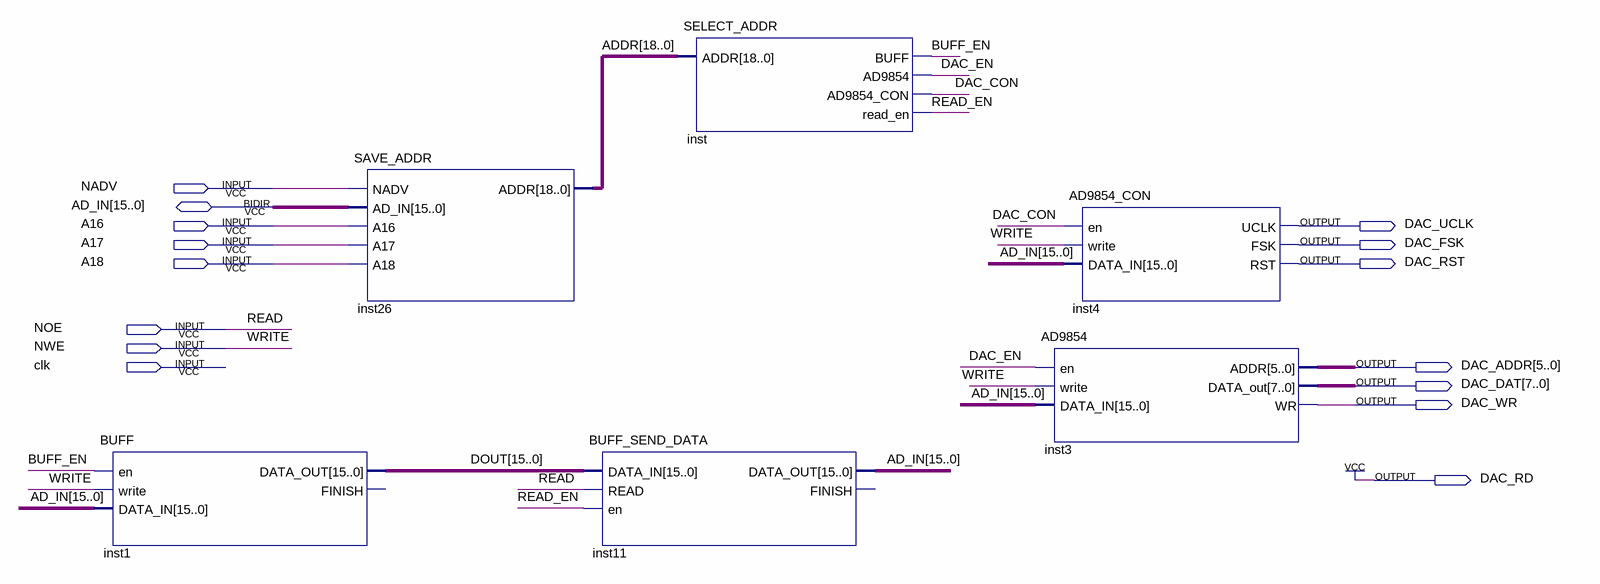
[diagram p0: schematic sheet]
// Quartus schematic CPLD_EXTEN.bdf as structural Verilog: 6 symbols, 15 pins
module CPLD_EXTEN (
  input  NADV,
  input  A16,
  input  A17,
  input  A18,
  input  NOE,
  input  NWE,
  input  clk,
  inout  [15:0] AD_IN,
  output DAC_UCLK,
  output DAC_FSK,
  output DAC_RST,
  output [5:0] DAC_ADDR,
  output [7:0] DAC_DAT,
  output DAC_WR,
  output DAC_RD
);

  wire BUFF_EN, DAC_CON, DAC_EN, READ_EN;
  wire [15:0] DOUT;
  wire [18:0] ADDR;

  BUFF inst1 (.en(BUFF_EN), .write(NWE), .DATA_IN(AD_IN), .DATA_OUT(DOUT));  // open: FINISH
  SAVE_ADDR inst26 (.NADV(NADV), .AD_IN(AD_IN), .A16(A16), .A17(A17), .A18(A18), .ADDR(ADDR));
  BUFF_SEND_DATA inst11 (.DATA_IN(DOUT), .READ(NOE), .en(READ_EN), .DATA_OUT(AD_IN));  // open: FINISH
  SELECT_ADDR inst (.ADDR(ADDR), .BUFF(BUFF_EN), .AD9854(DAC_EN), .AD9854_CON(DAC_CON), .read_en(READ_EN));
  AD9854 inst3 (.en(DAC_EN), .write(NWE), .DATA_IN(AD_IN), .ADDR(DAC_ADDR), .DATA_out(DAC_DAT), .WR(DAC_WR));
  AD9854_CON inst4 (.en(DAC_CON), .write(NWE), .DATA_IN(AD_IN), .UCLK(DAC_UCLK), .FSK(DAC_FSK), .RST(DAC_RST));

  assign DAC_RD = 1'b1;

  // Other names for the same wires on the sheet: READ = NOE; WRITE = NWE
endmodule
